# Altium schematic sheet 5 RF Directional Coupler.SchDoc: RF Directional Coupler
size A3; PageSetup: Record=PageOptions|CenterHorizontal=True|CenterVertical=True|PrintScale=1.01|XCorrection=1.00|YCorrection=1.00|PrintKind=2|BorderSize=5000000|LeftOffset=0|BottomOffset=0|Orientation=2|PaperLength=1000|PaperWidth=1000|Scale=100|PaperSource=15|PrintQuality=600|MediaType=1|DitherType=10|PaperKind=A3|PrintScaleMode=1; DocumentNumber: 4; SheetNumber: 6; SheetTotal: 7
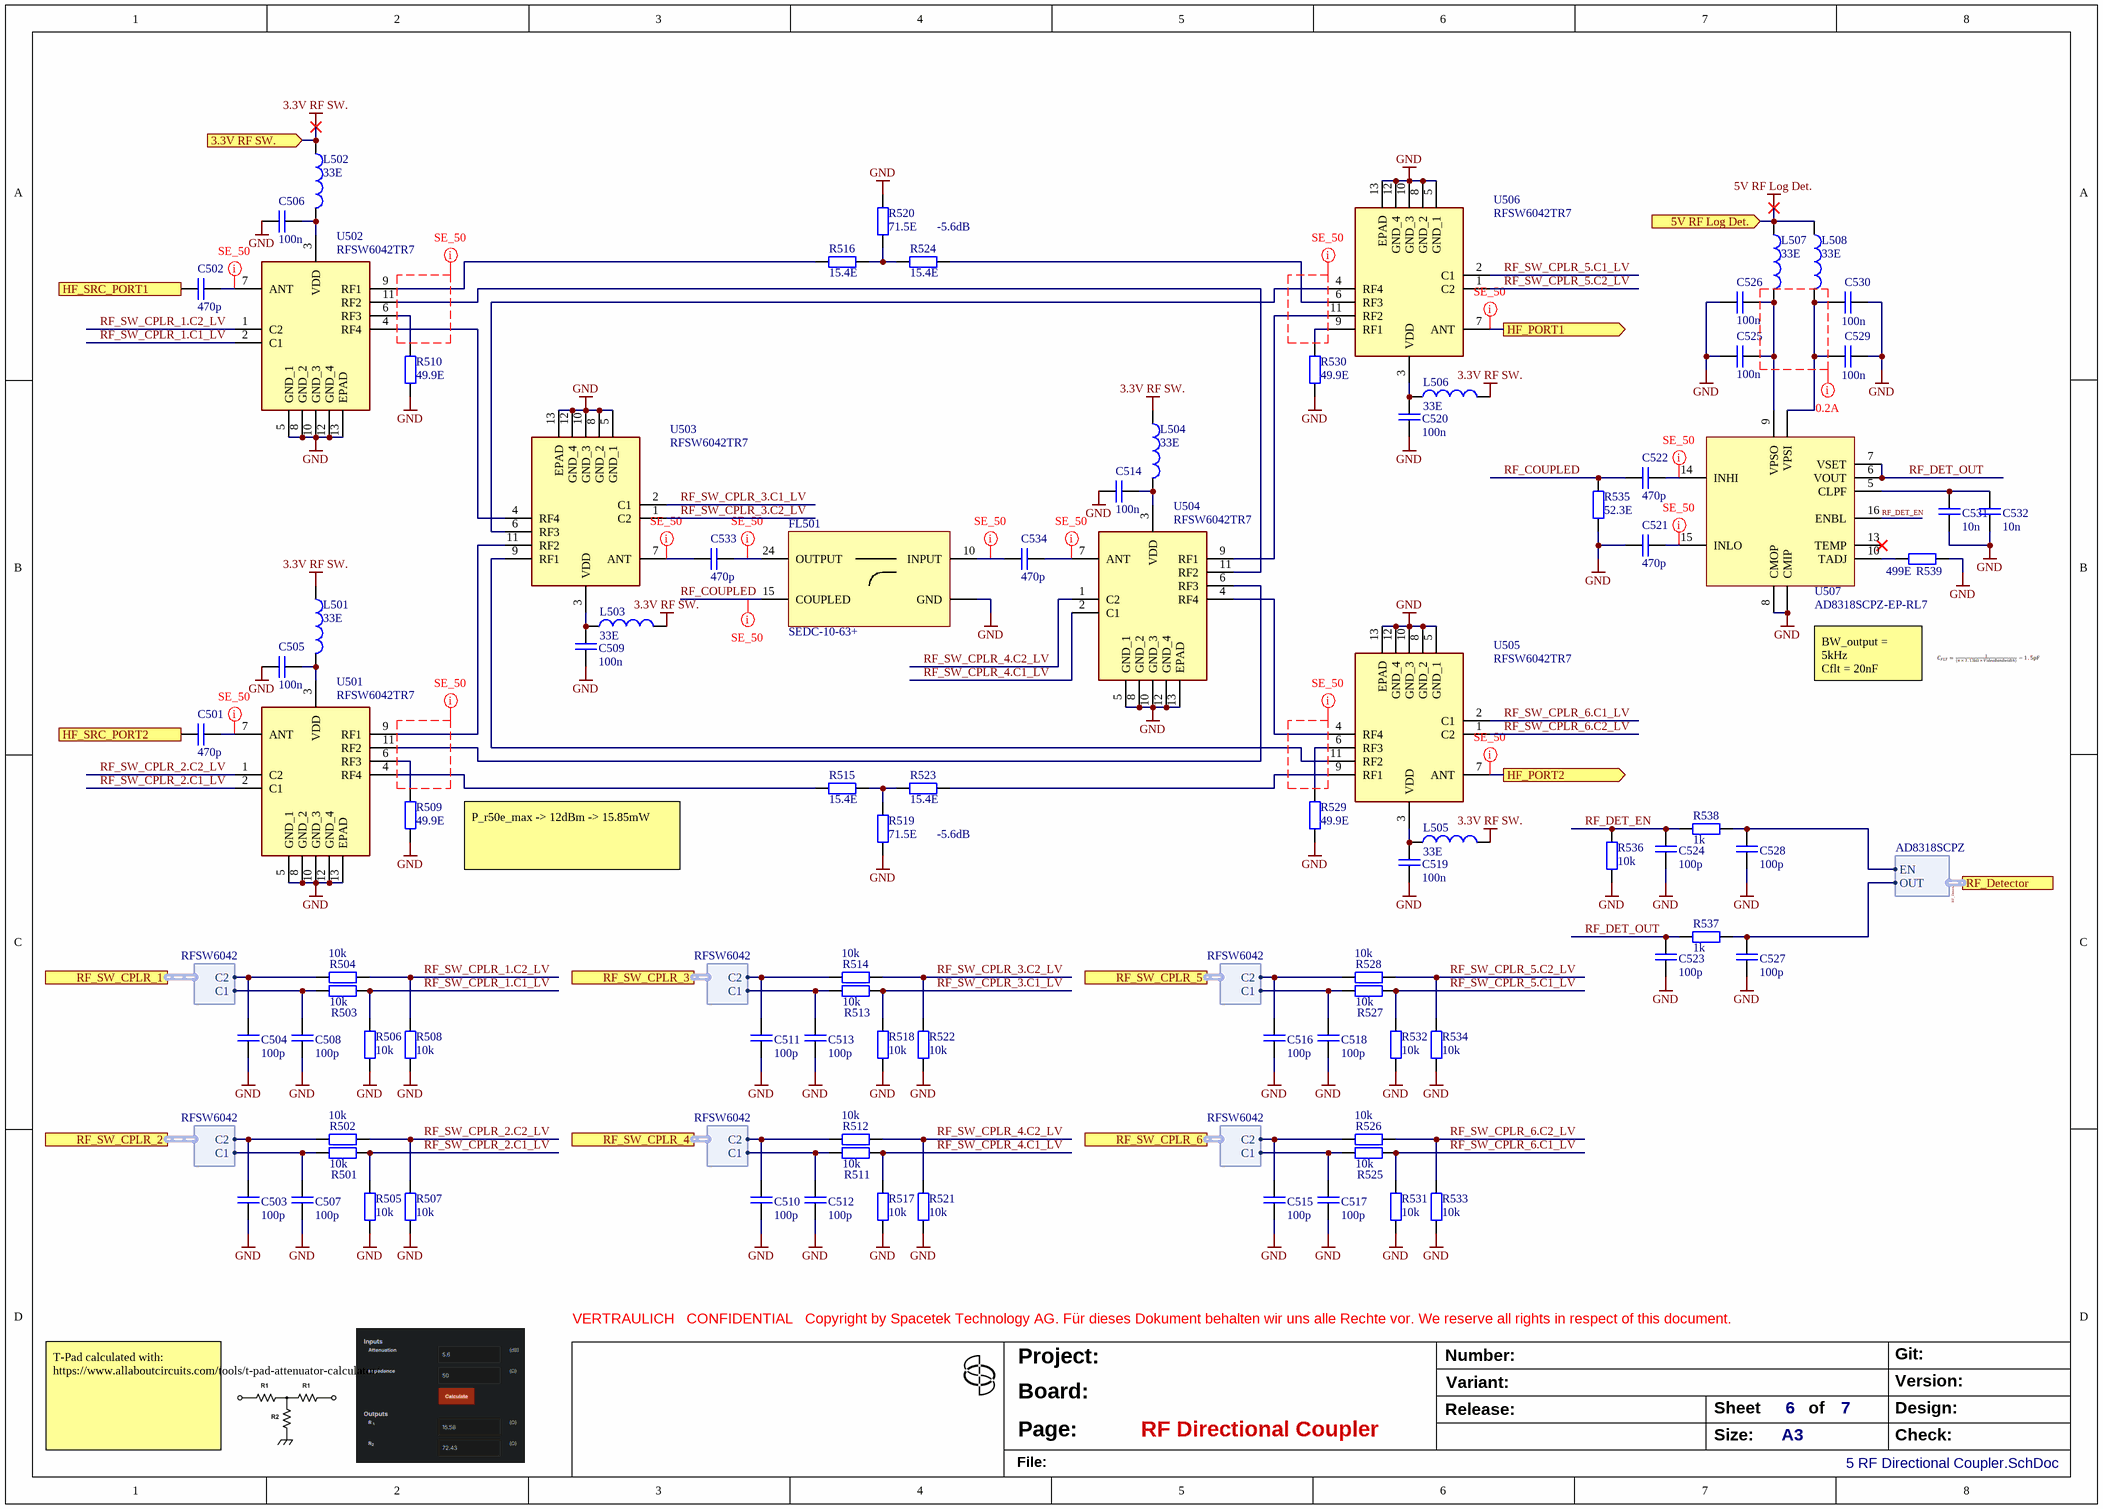
[diagram p0: 5 RF Directional Coupler.SchDoc]

## Parts
C501  470p  [STT--CC--0402]
C502  470p  [STT--CC--0402]
C503  100p  [STT--CC--0402]
C504  100p  [STT--CC--0402]
C505  100n  [STT--CC--0402]
C506  100n  [STT--CC--0402]
C507  100p  [STT--CC--0402]
C508  100p  [STT--CC--0402]
C509  100n  [STT--CC--0402]
C510  100p  [STT--CC--0402]
C511  100p  [STT--CC--0402]
C512  100p  [STT--CC--0402]
C513  100p  [STT--CC--0402]
C514  100n  [STT--CC--0402]
C515  100p  [STT--CC--0402]
C516  100p  [STT--CC--0402]
C517  100p  [STT--CC--0402]
C518  100p  [STT--CC--0402]
C519  100n  [STT--CC--0402]
C520  100n  [STT--CC--0402]
C521  470p  [STT--CC--0402]
C522  470p  [STT--CC--0402]
C523  100p  [STT--CC--0402]
C524  100p  [STT--CC--0402]
C525  100n  [STT--CC--0402]
C526  100n  [STT--CC--0402]
C527  100p  [STT--CC--0402]
C528  100p  [STT--CC--0402]
C529  100n  [STT--CC--0402]
C530  100n  [STT--CC--0402]
C531  10n  [STT--CC--0402]
C532  10n  [STT--CC--0402]
C533  470p  [STT--CC--0402]
C534  470p  [STT--CC--0402]
FL501  SEDC-10-63+  [MC--SEDC-10-63+]
L501  33E  [STT--FB--0402]
L502  33E  [STT--FB--0402]
L503  33E  [STT--FB--0402]
L504  33E  [STT--FB--0402]
L505  33E  [STT--FB--0402]
L506  33E  [STT--FB--0402]
L507  33E  [STT--FB--0402]
L508  33E  [STT--FB--0402]
R501  10k  [STT--RC--0402]
R502  10k  [STT--RC--0402]
R503  10k  [STT--RC--0402]
R504  10k  [STT--RC--0402]
R505  10k  [STT--RC--0402]
R506  10k  [STT--RC--0402]
R507  10k  [STT--RC--0402]
R508  10k  [STT--RC--0402]
R509  49.9E  [STT--RC--0402]
R510  49.9E  [STT--RC--0402]
R511  10k  [STT--RC--0402]
R512  10k  [STT--RC--0402]
R513  10k  [STT--RC--0402]
R514  10k  [STT--RC--0402]
R515  15.4E  [STT--RC--0402]
R516  15.4E  [STT--RC--0402]
R517  10k  [STT--RC--0402]
R518  10k  [STT--RC--0402]
R519  71.5E  [STT--RC--0402]
R520  71.5E  [STT--RC--0402]
R521  10k  [STT--RC--0402]
R522  10k  [STT--RC--0402]
R523  15.4E  [STT--RC--0402]
R524  15.4E  [STT--RC--0402]
R525  10k  [STT--RC--0402]
R526  10k  [STT--RC--0402]
R527  10k  [STT--RC--0402]
R528  10k  [STT--RC--0402]
R529  49.9E  [STT--RC--0402]
R530  49.9E  [STT--RC--0402]
R531  10k  [STT--RC--0402]
R532  10k  [STT--RC--0402]
R533  10k  [STT--RC--0402]
R534  10k  [STT--RC--0402]
R535  52.3E  [STT--RC--0402]
R536  10k  [STT--RC--0402]
R537  1k  [STT--RC--0402]
R538  1k  [STT--RC--0402]
R539  499E  [STT--RC--0402]
U501  RFSW6042TR7  [QV--IC--QFN-12]
U502  RFSW6042TR7  [QV--IC--QFN-12]
U503  RFSW6042TR7  [QV--IC--QFN-12]
U504  RFSW6042TR7  [QV--IC--QFN-12]
U505  RFSW6042TR7  [QV--IC--QFN-12]
U506  RFSW6042TR7  [QV--IC--QFN-12]
U507  AD8318SCPZ-EP-RL7  [ADI--AD8318SCPZ-EP-RL7]

## Ports
3.3V RF SW. (in), 5V RF Log Det. (in), HF_PORT1 (out), HF_PORT2 (out), HF_SRC_PORT1 (in), HF_SRC_PORT2 (in), RF_Detector (harness AD8318SCPZ), RF_SW_CPLR_1 (harness RFSW6042), RF_SW_CPLR_2 (harness RFSW6042), RF_SW_CPLR_3 (harness RFSW6042), RF_SW_CPLR_4 (harness RFSW6042), RF_SW_CPLR_5 (harness RFSW6042), RF_SW_CPLR_6 (harness RFSW6042)

## Harnesses
RFSW6042: C1, C2
AD8318SCPZ: EN, OUT

## Nets
3.3V RF SW.: L501.1 L502.1 L503.1 L504.1 L505.1 L506.1 ; port 3.3V RF SW.
5V RF Log Det.: L507.1 L508.1 ; port 5V RF Log Det.
GND: C503.1 C504.1 C505.1 C506.1 C507.1 C508.1 C509.1 C510.1 C511.1 C512.1 C513.1 C514.1 C515.1 C516.1 C517.1 C518.1 C519.1 C520.1 C521.1 C523.1 C524.1 C525.1 C526.1 C527.1 C528.1 C529.1 C530.1 C531.1 C532.1 FL501.1,2,3,4,5,6,7,8,9,11,12,13,14,16,17,18,19,20,21,22,23,25(GND) R505.2 R506.2 R507.2 R508.2 R509.1 R510.1 R517.2 R518.2 R519.1 R520.1 R521.2 R522.2 R529.1 R530.1 R531.2 R532.2 R533.2 R534.2 R535.1 R536.1 R539.2 U501.5(GND_1) U501.8(GND_2) U501.10(GND_3) U501.12(GND_4) U501.13(EPAD) U502.5(GND_1) U502.8(GND_2) U502.10(GND_3) U502.12(GND_4) U502.13(EPAD) U503.5(GND_1) U503.8(GND_2) U503.10(GND_3) U503.12(GND_4) U503.13(EPAD) U504.5(GND_1) U504.8(GND_2) U504.10(GND_3) U504.12(GND_4) U504.13(EPAD) U505.5(GND_1) U505.8(GND_2) U505.10(GND_3) U505.12(GND_4) U505.13(EPAD) U506.5(GND_1) U506.8(GND_2) U506.10(GND_3) U506.12(GND_4) U506.13(EPAD) U507.1,2,11,12,17(CMIP) U507.8(CMOP)
HF_PORT1: U506.7(ANT) ; port HF_PORT1
HF_PORT2: U505.7(ANT) ; port HF_PORT2
HF_SRC_PORT1: C502.1 ; port HF_SRC_PORT1
HF_SRC_PORT2: C501.1 ; port HF_SRC_PORT2
RF_COUPLED: C522.1 FL501.15(COUPLED) R535.2
RF_DET_EN: C524.2 R536.2 R538.1 U507.16(ENBL)
RF_DET_OUT: C523.2 R537.1 U507.6(VOUT) U507.7(VSET)
RF_Detector.EN: C528.2 R538.2 ; port RF_Detector.EN
RF_Detector.OUT: C527.2 R537.2 ; port RF_Detector.OUT
RF_SW_CPLR_1.C1: C508.2 R503.1 ; port RF_SW_CPLR_1.C1
RF_SW_CPLR_1.C1_LV: R503.2 R506.1 U502.2(C1)
RF_SW_CPLR_1.C2: C504.2 R504.1 ; port RF_SW_CPLR_1.C2
RF_SW_CPLR_1.C2_LV: R504.2 R508.1 U502.1(C2)
RF_SW_CPLR_2.C1: C507.2 R501.1 ; port RF_SW_CPLR_2.C1
RF_SW_CPLR_2.C1_LV: R501.2 R505.1 U501.2(C1)
RF_SW_CPLR_2.C2: C503.2 R502.1 ; port RF_SW_CPLR_2.C2
RF_SW_CPLR_2.C2_LV: R502.2 R507.1 U501.1(C2)
RF_SW_CPLR_3.C1: C513.2 R513.1 ; port RF_SW_CPLR_3.C1
RF_SW_CPLR_3.C1_LV: R513.2 R518.1 U503.2(C1)
RF_SW_CPLR_3.C2: C511.2 R514.1 ; port RF_SW_CPLR_3.C2
RF_SW_CPLR_3.C2_LV: R514.2 R522.1 U503.1(C2)
RF_SW_CPLR_4.C1: C512.2 R511.1 ; port RF_SW_CPLR_4.C1
RF_SW_CPLR_4.C1_LV: R511.2 R517.1 U504.2(C1)
RF_SW_CPLR_4.C2: C510.2 R512.1 ; port RF_SW_CPLR_4.C2
RF_SW_CPLR_4.C2_LV: R512.2 R521.1 U504.1(C2)
RF_SW_CPLR_5.C1: C518.2 R527.1 ; port RF_SW_CPLR_5.C1
RF_SW_CPLR_5.C1_LV: R527.2 R532.1 U506.2(C1)
RF_SW_CPLR_5.C2: C516.2 R528.1 ; port RF_SW_CPLR_5.C2
RF_SW_CPLR_5.C2_LV: R528.2 R534.1 U506.1(C2)
RF_SW_CPLR_6.C1: C517.2 R525.1 ; port RF_SW_CPLR_6.C1
RF_SW_CPLR_6.C1_LV: R525.2 R531.1 U505.2(C1)
RF_SW_CPLR_6.C2: C515.2 R526.1 ; port RF_SW_CPLR_6.C2
RF_SW_CPLR_6.C2_LV: R526.2 R533.1 U505.1(C2)
NetC501_2: C501.2 U501.7(ANT)
NetC502_2: C502.2 U502.7(ANT)
NetC505_2: C505.2 L501.2 U501.3(VDD)
NetC506_2: C506.2 L502.2 U502.3(VDD)
NetC509_2: C509.2 L503.2 U503.3(VDD)
NetC514_2: C514.2 L504.2 U504.3(VDD)
NetC519_2: C519.2 L505.2 U505.3(VDD)
NetC520_2: C520.2 L506.2 U506.3(VDD)
NetC521_2: C521.2 U507.15(INLO)
NetC522_2: C522.2 U507.14(INHI)
NetC525_2: C525.2 C526.2 L507.2 U507.9(VPSO)
NetC529_2: C529.2 C530.2 L508.2 U507.3,4(VPSI)
NetC531_2: C531.2 C532.2 U507.5(CLPF)
NetC533_1: C533.1 U503.7(ANT)
NetC533_2: C533.2 FL501.24(OUTPUT)
NetC534_1: C534.1 FL501.10(INPUT)
NetC534_2: C534.2 U504.7(ANT)
NetR509_2: R509.2 U501.6(RF3)
NetR510_2: R510.2 U502.6(RF3)
NetR515_1: R515.1 U501.4(RF4)
NetR515_2: R515.2 R519.2 R523.1
NetR516_1: R516.1 R520.2 R524.2
NetR516_2: R516.2 U502.9(RF1)
NetR523_2: R523.2 U505.9(RF1)
NetR524_1: R524.1 U506.6(RF3)
NetR529_2: R529.2 U505.6(RF3)
NetR530_2: R530.2 U506.9(RF1)
NetR539_1: R539.1 U507.10(TADJ)
NetU501_9: U501.9(RF1) U503.11(RF2)
NetU501_11: U501.11(RF2) U504.6(RF3)
NetU502_4: U502.4(RF4) U503.4(RF4)
NetU502_11: U502.11(RF2) U504.11(RF2)
NetU503_6: U503.6(RF3) U506.4(RF4)
NetU503_9: U503.9(RF1) U505.11(RF2)
NetU504_4: U504.4(RF4) U505.4(RF4)
NetU504_9: U504.9(RF1) U506.11(RF2)

Not connected (* = marked no-connect by the designer): U507 13(TEMP)*

## Buses and harness runs
harness RF_Detector = port RF_Detector
harness RF_SW_CPLR_1 = port RF_SW_CPLR_1
harness RF_SW_CPLR_2 = port RF_SW_CPLR_2
harness RF_SW_CPLR_3 = port RF_SW_CPLR_3
harness RF_SW_CPLR_4 = port RF_SW_CPLR_4
harness RF_SW_CPLR_5 = port RF_SW_CPLR_5
harness RF_SW_CPLR_6 = port RF_SW_CPLR_6

## Layout directives
net class SE_50: (no net found under the mark), HF_PORT1, HF_PORT2, NetC501_2, NetC502_2, NetC521_2, NetC522_2, NetC533_1, NetC533_2, NetC534_1, NetC534_2, RF_COUPLED
net class 0.2A: (no net found under the mark)

## Notes on the sheet
- (near R524) -5.6dB
- (near U507) BW_output = 5kHz
  Cflt = 20nF
- -5.6dB
- P_r50e_max -> 12dBm -> 15.85mW
- T-Pad calculated with: https://www.allaboutcircuits.com/tools/t-pad-attenuator-calculator/
- VERTRAULICH   CONFIDENTIAL   Copyright by Spacetek Technology AG. Für dieses Dokument behalten wir uns alle Rechte vor. We reserve all rights in respect of this document.
- Project:
- Number:
- Variant:
- Version:
- Git:
- Board:
- Page:
- Release:
- Size:
- Sheet
- A3
- of
- Design:
- Check:
- File:

## Library data of the parts
C501 C502 C521 C522 C533 C534 = CMP-010-000105-1: Capacitor ceramic 470p 50V 5% C0G  SMD--0402; Manufacturer: TDK; Partnumber: CGA2B2C0G1H471J050BA; Component Category: Generic; Meta Data Version: v1.0; Status: released; Value: 470p
C503 C504 C507 C508 C510-C513 C515-C518 C523 C524 C527 C528 = CMP-010-000109-1: Capacitor ceramic 100p 50V 5% C0G AEC-Q200 SMD--0402; Partnumber: CL05C101JB51PND; Manufacturer: Samsung Electro-Mechanics; Component Category: Generic; Meta Data Version: v1.0; Package: SMD--0402; Status: released; Type: Capacitor ceramic; Value: 100p
C505 C506 C509 C514 C519 C520 C525 C526 C529 C530 = 200032-3: Capacitor ceramic 100n 16V 10% X7R  SMD--0402; Partnumber: CL05B104KO5NNNC; Manufacturer: Samsung Electro-Mechanics; A-Number: 200032; Material: X7R; Voltage: 16V; Type: Capacitor ceramic; Tolerance: 10%; Status: released; Package: SMD--0402; Value: 100n
C531 C532 = CMP-010-000007-3: Capacitor ceramic 10n 35V 2% C0G SMD--0402; Manufacturer: Murata Electronics; Partnumber: GRM1555CYA103GE01; A-Number: 200032; Voltage: 35V; Status: released; Tolerance: 2%; Type: Capacitor ceramic; Package: SMD--0402; Material: C0G; Value: 10n
FL501 = CMP-042-000029-3: Directional Coupler, 50 MHz to 6 GHz, 50 Ohms, SMD; Manufacturer: Mini-Circuits; Meta Data Version: v1.0; Component Category: Generic; Status: released; Type: Directional Coupler; Partnumber: SEDC-10-63+; Value: SEDC-10-63+
L501-L508 = 300015-1: Ferrit Bead MPZ1005S330HT000 33E 3A 22mE SMD--0402; Manufacturer: TDK Group; preferred: Yes; A-Number: 300015; Status: active; Current: 3A; Type: Ferrit Bead; Value: 33E; Package: MPZ1005S330HT000; Special: 22mE; Partnumber: MPZ1005S330HT000
R501-R508 R511-R514 R517 R518 R521 R522 R525-R528 R531-R534 R536 = 100086-1: Resistor 10k 50V  0.063W 1%  SMD--0402; Partnumber: ERJ-2RKF1002X; Manufacturer: Panasonic; A-Number: 100086; Power: 0.063W; Status: released; Type: Resistor; Voltage: 50V; Tolerance: 1%; Value: 10k; Package: SMD--0402
R509 R510 R529 R530 = CMP-009-000262-1: Resistor 49.9E 50V 0.1W 1% SMD--0402; Partnumber: RNCP0402FTD49R9; Manufacturer: SEI Stackpole; Component Category: Generic; Meta Data Version: v1.0; Value: 49.9E; Status: released
R515 R516 R523 R524 = CMP-009-000261-1: Resistor 15.4E 50V 0.1W 0.1% SMD--0402; Manufacturer: TE Connectivity; Partnumber: RP73PF1E15R4BTDF; Component Category: Generic; Meta Data Version: v1.0; Value: 15.4E; Status: released
R519 R520 = CMP-009-000263-1: Resistor 71.5E 50V 0.0625W 0.1% SMD--0402; Manufacturer: Panasonic; Partnumber: ERA-2AEB71R5X; Component Category: Generic; Meta Data Version: v1.0; Value: 71.5E; Status: released
R535 = CMP-009-000265-1: Resistor 52.3E 50V 0.1W 0.1% SMD--0402; Partnumber: RP73PF1E52R3BTD; Manufacturer: TE Connectivity; Component Category: Generic; Meta Data Version: v1.0; Type: Resistor; Value: 52.3E; Status: released
R537 R538 = 100077-2: Resistor 1k 50V  0.063W 1%  SMD--0402; Partnumber: ERJ-2RKF1001X; Manufacturer: Panasonic; A-Number: 100077; Power: 0.063W; Value: 1k; Status: released; Package: SMD--0402; Type: Resistor; Tolerance: 1%; Voltage: 50V
R539 = 100089-1: Resistor 499E 50V  0.063W 1%  SMD--0402; Manufacturer: Yageo; Partnumber: RC0402FR-07499RL; A-Number: 100089; Value: 499E; Voltage: 50V; Tolerance: 1%; Package: SMD--0402; Status: released; Power: 0.063W; Type: Resistor
U501-U506 = CMP-081-000011-1: RF Switch RFSW6042TR7  5-6000MHz SP4T Iso 36dB @925MHz; Manufacturer: Qorvo; Component Category: Generic; Meta Data Version: v1.0; Partnumber: RFSW6042TR7; Status: released; Value: RFSW6042TR7; Type: RF-Switch
U507 = CMP-042-000030-1: HF-Detector 1MHz to 8GHz; Manufacturer: Analog Devices; Meta Data Version: v1.0; Component Category: Generic; Value: AD8318SCPZ-EP-RL7; Partnumber: AD8318SCPZ-EP-RL7; Type: HF-Detector; Status: released